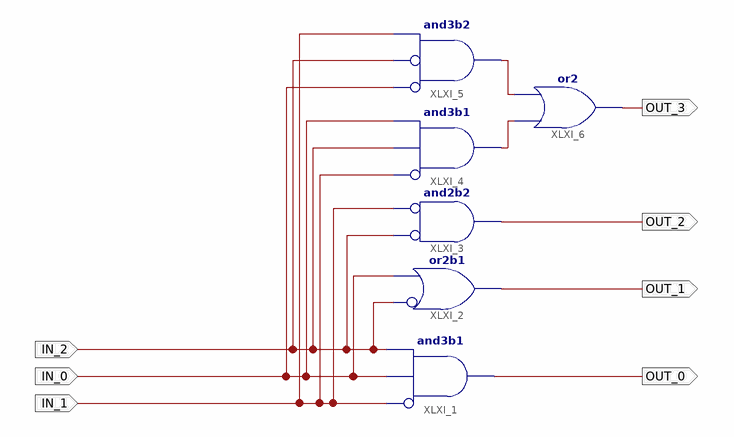
[diagram p0: schematic sheet 1]
// Xilinx ISE schematic My3To4Decoder.sch (spartan3a) as structural Verilog: 6 symbols, 7 ports
module My3To4Decoder (
  input  IN_1,
  input  IN_0,
  input  IN_2,
  output OUT_0,
  output OUT_1,
  output OUT_2,
  output OUT_3
);

  wire XLXN_14, XLXN_15;

  and XLXI_1 (OUT_0, ~IN_1, IN_0, IN_2);  // and3b1
  or XLXI_2 (OUT_1, ~IN_2, IN_0);  // or2b1
  and XLXI_3 (OUT_2, ~IN_2, ~IN_1);  // and2b2
  and XLXI_4 (XLXN_15, ~IN_1, IN_2, IN_0);  // and3b1
  and XLXI_5 (XLXN_14, ~IN_0, ~IN_2, IN_1);  // and3b2
  or XLXI_6 (OUT_3, XLXN_15, XLXN_14);
endmodule
